# Altium project 多谐震荡器.PrjPcb
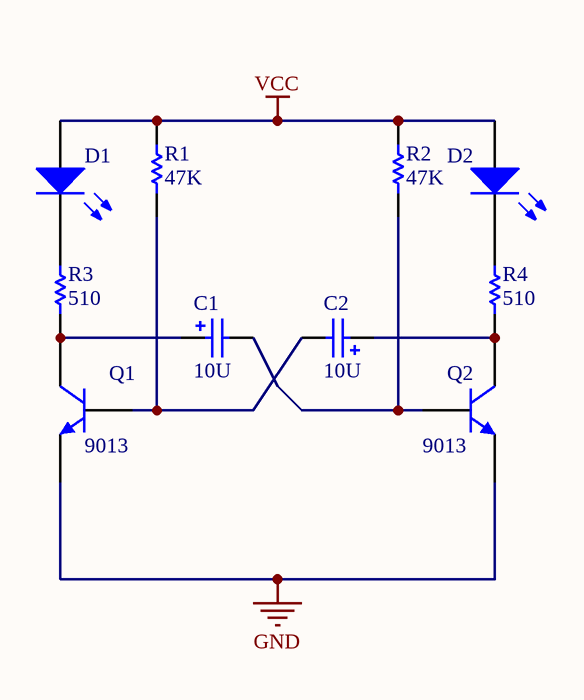
[diagram p0: Sheet1.SchDoc]
1 sheet, 10 parts. Net scope: global (net labels, ports and power ports of the same name join across sheets).
Board file: PCB1.PcbDoc

## Sheet Sheet1.SchDoc
size A4

### Parts
C1  10U  [CAPPR2-5x6.8]
C2  10U  [CAPPR2-5x6.8]
D1  (no value)  [CAPPR2-5x6.8]
D2  (no value)  [CAPPR2-5x6.8]
Q1  9013  [BCY-W3/E4]
Q2  9013  [BCY-W3/E4]
R1  47K  [AXIAL-0.3]
R2  47K  [AXIAL-0.3]
R3  510  [AXIAL-0.3]
R4  510  [AXIAL-0.3]

### Nets
GND: Q1.1(E) Q2.1(E)
VCC: D1.1(A) D2.1(A) R1.2 R2.2
NetC1_1: C1.1 Q1.3(C) R3.1
NetC1_2: C1.2 Q2.2(B) R2.1
NetC2_1: C2.1 Q2.3(C) R4.1
NetC2_2: C2.2 Q1.2(B) R1.1
NetD1_2: D1.2(K) R3.2
NetD2_2: D2.2(K) R4.2

### Library data of the parts
C1 C2 = Cap Pol2: Polarized Capacitor (Axial); Value: 100pF; Published: 8-Jun-2000; LatestRevisionDate: 17-Jul-2002; LatestRevisionNote: Re-released for DXP Platform.; PackageReference: POLAR0.8; Publisher: Altium Limited
D1 D2 = LED0: Typical INFRARED GaAs LED; Published: 8-Jun-2000; LatestRevisionDate: 08-Jul-2005; LatestRevisionNote: Mech Layer 1 removed.; PackageReference: LED-0; Publisher: Altium Limited
Q1 Q2 = 2N3904: NPN General Purpose Amplifier; Published: 8-Jun-2000; LatestRevisionDate: 15-Jan-2003; LatestRevisionNote: PCB Footprint 'BCY-W3/D4.7' replaced; DatasheetVersion: 1997; PackageVersion: Sep-1998; PackageReference: TO-92A; Publisher: Altium Limited; Code_JEDEC: TO-92A; ComponentLink1Description: Manufacturer Link; ComponentLink1URL: http://www.fairchildsemi.com/; ComponentLink2Description: Datasheet; ComponentLink2URL: http://www.fairchildsemi.com/ds/2N%2F2N3904.pdf
R1-R4 = Res1: Resistor; Value: 1K; Published: 8-Jun-2000; LatestRevisionDate: 17-Jul-2002; LatestRevisionNote: Re-released for DXP Platform.; PackageReference: AXIAL-0.3; Publisher: Altium Limited